# Altium schematic sheet CubSat2.SchDoc: CubSat
size A4; DrawnBy: Maymoun Jabnouni; SheetNumber: 2; SheetTotal: 3; SPICEModelCachePMNLYOBT: <root> / <DocumentId>PMNLYOBT</DocumentId> / <CacheFrame Number="0"> / <Model Name="cap" Kind="MDL"> / <Text>*Default semiconductor capacitor / .MODEL CAP C()</Text> / </Model> / </CacheFrame> / </root>
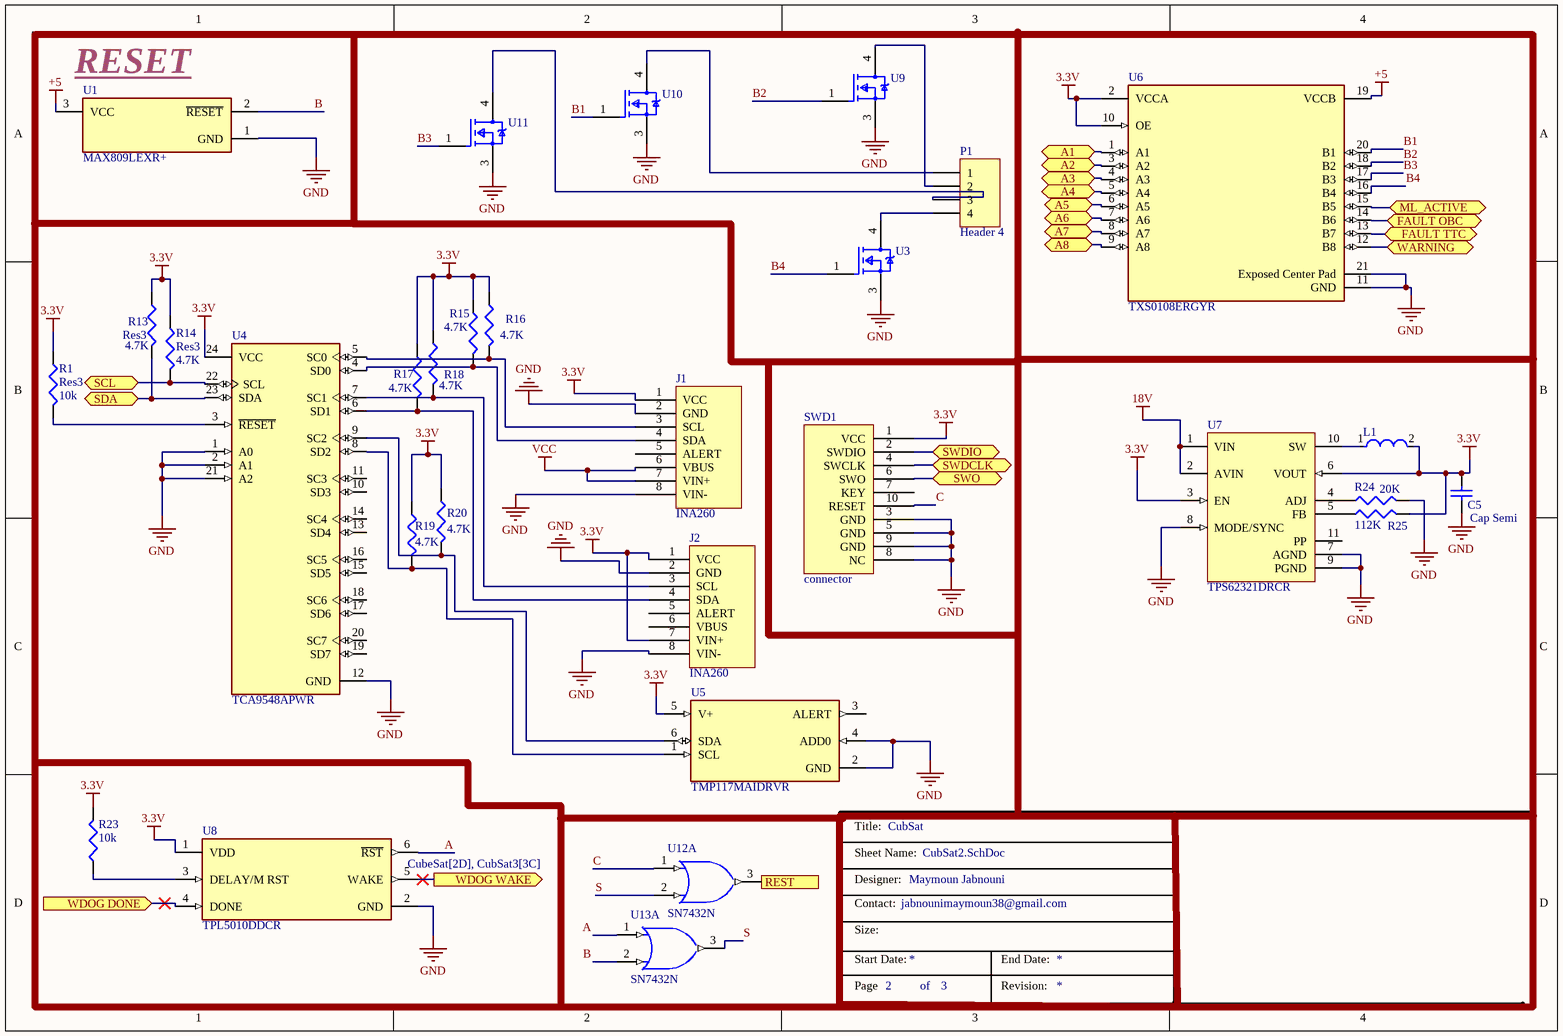
[diagram p0: CubSat2.SchDoc]

## Parts
C5  Cap Semi  [C1206]
J1  INA260  [INA260]
J2  INA260  [INA260]
L1  LQW31HN64NJ03L  [FP-LQW31HN_03-MFG]  (value not drawn)
P1  Header 4  [HDR1X4]
R1  Res3  value 10k  [J1-0603]
R13  Res3  value 4.7K  [J1-0603]
R14  Res3  value 4.7K  [J1-0603]
R15  value 4.7K  [J1-0603]  (hidden comment: Res3)
R16  value 4.7K  [J1-0603]  (hidden comment: Res3)
R17  value 4.7K  [J1-0603]  (hidden comment: Res3)
R18  value 4.7K  [J1-0603]  (hidden comment: Res3)
R19  value 4.7K  [J1-0603]  (hidden comment: Res3)
R20  value 4.7K  [J1-0603]  (hidden comment: Res3)
R23  value 10k  [J1-0603]  (hidden comment: Res3)
R24  value 20K  [J1-0603]  (hidden comment: Res3)
R25  value 112K  [J1-0603]  (hidden comment: Res3)
SWD1  connector  [SWD]
U1  MAX809LEXR+  [FP-X3-2-IPC_B]
U3  IRLR8743TRLPBF  [FP-PG-TO252-3-MFG]  (value not drawn)
U4  TCA9548APWR  [FP-PW0024A-MFG]
U5  TMP117MAIDRVR  [FP-DRV0006B-IPC_C]
U6  TXS0108ERGYR  [FP-RGY0020A-MFG]
U7  TPS62321DRCR  [DRC0010J_V]
U8  TPL5010DDCR  [FP-DDC0006A-MFG]
U9  IRLR8743TRLPBF  [FP-PG-TO252-3-MFG]  (value not drawn)
U10  IRLR8743TRLPBF  [FP-PG-TO252-3-MFG]  (value not drawn)
U11  IRLR8743TRLPBF  [FP-PG-TO252-3-MFG]  (value not drawn)
U12  SN7432N  [N0014A]  (part A of 5)
U13  SN7432N  [N0014A]  (part A of 5)

## Ports
A1 (bidir, see CubeSat[2D]), A2 (bidir, see CubeSat[2D]), A3 (bidir, see CubeSat[2D]), A4 (bidir, see CubeSat[2D]), A5 (bidir, see CubeSat[1C]), A6 (bidir, see CubeSat[1C]), A7 (bidir, see CubeSat[1C]), A8 (bidir, see CubeSat[1C]), FAULT OBC (bidir, see CubSat3[1C]), FAULT TTC (bidir, see CubSat3[1D]), ML_ACTIVE (bidir, see CubSat3[2A]), REST (out, see CubeSat[1C]), SCL (bidir, see CubeSat[2A]), SDA (bidir, see CubeSat[2A]), SWDCLK (bidir, see CubeSat[3A], CubSat3[3C]), SWDIO (bidir, see CubeSat[3B], CubSat3[3C]), SWO (bidir, see CubeSat[2A]), WARNING (bidir, see CubSat3[3A]), WDOG DONE (in, see CubeSat[2D], CubSat3[3C]), WDOG WAKE (out, see CubeSat[2D], CubSat3[3C])

## Nets
3.3V: C5.2 J1.1(VCC) J2.1(VCC) J2.7(VIN+) L1.2 R1.1 R13.1 R14.1 R15.1 R16.1 R17.1 R18.1 R19.1 R20.1 R23.2 R25.2 SWD1.1(VCC) U4.24(VCC) U5.5(V+) U6.2(VCCA) U6.10(OE) U7.3(EN) U7.6(VOUT) U8.1(VDD)
18V: U7.1(VIN) U7.2(AVIN)
+5: U1.3(VCC) U6.19(VCCB)
GND: C5.1 J1.2(GND) J1.8(VIN-) J2.2(GND) J2.8(VIN-) R24.2 SWD1.3(GND) SWD1.5(GND) SWD1.8(NC) SWD1.9(GND) U1.1(GND) U3.3(S) U4.1(A0) U4.2(A1) U4.12(GND) U4.21(A2) U5.2(GND) U5.4(ADD0) U6.11(GND) U6.21(Exposed_Center_Pad) U7.7(AGND) U7.8(MODE/SYNC) U7.9(PGND) U8.2(GND) U9.3(S) U10.3(S) U11.3(S)
VCC: J1.6(VBUS) J1.7(VIN+)
A: U8.6(~{RST}) U13.1(1A)
A1: U6.1(A1) ; port A1
A2: U6.3(A2) ; port A2
A3: U6.4(A3) ; port A3
A4: U6.5(A4) ; port A4
A5: U6.6(A5) ; port A5
A6: U6.7(A6) ; port A6
A7: U6.8(A7) ; port A7
A8: U6.9(A8) ; port A8
B: U1.2(~{RESET}) U13.2(1B)
B1: U6.20(B1) U10.1(G)
B2: U6.18(B2) U9.1(G)
B3: U6.17(B3) U11.1(G)
B4: U3.1(G) U6.16(B4)
C: SWD1.10(RESET) U12.1(1A)
FAULT OBC: U6.14(B6) ; port FAULT OBC
FAULT TTC: U6.13(B7) ; port FAULT TTC
ML_ACTIVE: U6.15(B5) ; port ML_ACTIVE
REST: U12.3(1Y) ; port REST
S: U12.2(1B) U13.3(1Y)
SCL: R14.2 U4.22(SCL) ; port SCL
SDA: R13.2 U4.23(SDA) ; port SDA
SWDCLK: SWD1.4(SWCLK) ; port SWDCLK
SWDIO: SWD1.2(SWDIO) ; port SWDIO
SWO: SWD1.6(SWO) ; port SWO
WARNING: U6.12(B8) ; port WARNING
WDOG DONE: U8.4(DONE) ; port WDOG DONE
WDOG WAKE: U8.5(WAKE) ; port WDOG WAKE
NetJ1_3: J1.3(SCL) R16.2 U4.5(SC0)
NetJ1_4: J1.4(SDA) R15.2 U4.4(SD0)
NetJ2_3: J2.3(SCL) R18.2 U4.7(SC1)
NetJ2_4: J2.4(SDA) R17.2 U4.6(SD1)
NetL1_1: L1.1 U7.10(SW)
NetP1_1: P1.1 U10.4(D)
NetP1_2: P1.2 U9.4(D)
NetP1_3: P1.3 U11.4(D)
NetP1_4: P1.4 U3.4(D)
NetR1_2: R1.2 U4.3(~{RESET})
NetR19_2: R19.2 U4.8(SD2) U5.1(SCL)
NetR20_2: R20.2 U4.9(SC2) U5.6(SDA)
NetR23_1: R23.1 U8.3(DELAY/M_RST)
NetR24_1: R24.1 U7.4(ADJ)
NetR25_1: R25.1 U7.5(FB)

Not connected (* = marked no-connect by the designer): J1 5(ALERT); J2 5(ALERT) 6(VBUS); SWD1 7(KEY); U4 10(SD3) 11(SC3) 13(SD4) 14(SC4) 15(SD5) 16(SC5) 17(SD6) 18(SC6) 19(SD7) 20(SC7); U5 3(ALERT); U7 11(PP)

## Notes on the sheet
- (near U1) RESET
- Title:
- Sheet Name:
- Designer:
- Contact:
- jabnounimaymoun38@gmail.com
- Size:
- Start Date:
- Page
- of
- End Date:
- Revision:

## Library data of the parts
C5 = Cap Semi: Capacitor (Semiconductor SIM Model); Value: 100pF; Published: 8-Jun-2000; LatestRevisionDate: 29-May-2009; LatestRevisionNote: IPC-7351 Footprint Added.; PackageReference: C1206; Publisher: Altium Limited; PackageDescription: Chip Capacitor
L1 = CMP-06042-010302-1: Wire Wound RF Inductor 64nH ±5% 0.252Ω 290mA 1206; Shielding: Unshielded; Core Material: Ferrite; Self Resonant Frequency: 1GHz; DC Resistance (DCR): 180mR; Q Factor: 60; Test Frequency: 100MHz; Height - Seated (Max): 0.079inch; Max DC Current: 290mA; Radiation Hardening: No; Height: 1.8mm; Tolerance: 5%; Case Code (Metric): 3216; Min Operating Temperature: -55°C; Inductance: 64nH; Weight: 0.000705oz; Length: 3.2mm; Termination: SMD/SMT; Package Quantity: 2000; Packaging: Tape and Reel; Case/Package: 1206; DC Current: 290mA; Military Standard: Not; Max Operating Temperature: 85°C; Depth: 1.8mm; Resistor Type: Wirewound; Case Code (Imperial): 1206; Mount: Surface Mount; Current Rating: 290mA; Width: 1.6mm
P1 = Header 4: Header, 4-Pin; LatestRevisionDate: 17-Jul-2002; LatestRevisionNote: Re-released for DXP Platform.; Publisher: Altium Limited
R1 R13-R20 R23-R25 = Res3: Resistor; Published: 8-Jun-2000; LatestRevisionDate: 29-May-2009; LatestRevisionNote: IPC-7351 Footprint Added.; PackageReference: J1-0603; Publisher: Altium Limited; PackageDescription: Chip Resistor
SWD1 = SWD
U1 = CMP-05723-000292-1: Supervisory Circuits 3-Pin Microprocessor Reset Circuits; Max Supply Voltage: 5.5V; Min Reset Threshold Voltage: 4.56V; Max Power Dissipation: 174mW; Min Supply Voltage: 1.2V; Watchdog Timer: No; Max Reset Threshold Voltage: 4.7V; Radiation Hardening: No; Min Operating Temperature: -40°C; Max Operating Temperature: 125°C; Packaging: Rail/Tube; Mount: Surface Mount; RoHS Compliant: No
U3 U9-U11 = CMP-32901-000199-1: MOSFET N-CH 30V 160A DPAK; Input Capacitance: 4.88nF; Rds On Max: 3.1mR; Max Power Dissipation: 135W; Number of Pins: 3; Min Operating Temperature: -55°C; Case/Package: TO-252-3; Mount: Surface Mount; Halogen Free: Halogen Free; Max Dual Supply Voltage: 30V; RoHS Compliant: Yes; Continuous Drain Current (ID): 160A; Drain to Source Voltage (Vdss): 30V; Packaging: Tape and Reel; Max Operating Temperature: 175°C; Lead Free: Contains Lead
U4 = CMP-04892-000002-1: IC I2C SW 8CH W/RESET 24TSSOP; Manufacturer: Texas Instruments; Number Of Circuits: 1; Mux Demux Ratio: 1:8; Nominal Supply Current: 2-50uA; Interface: I2C,SMBus; Min Supply Voltage: 1.65V; Standoff Height: 0.05mm; Max Supply Voltage: 5.5V; Device Class L2: Interface ICs; ComponentLink2Description: Datasheet; Ipc Land Pattern Name: SOP65P640X120-24; Category: IC; Device Class L1: Integrated Circuits (ICs); Manufacturer Part Number: TCA9548APWR; RoHS: TRUE; Temperature Range High: +85°C; Digikey Description: IC I2C SW 8CH W/RESET 24TSSOP; Temperature Range Low: -40°C; Lead Free: Yes; Package: PW0024A; ComponentLink2URL: http://www.ti.com/lit/ds/symlink/tca9548a.pdf; Device Class L3: Multiplexers; Ambient Temperature Range Low: -40°C; Mouser Description: Low-Voltage 8-Channel I2C Switch With Reset 24-TSSOP -40 to 85; Temperature: -40°C to +85°C; Octopart: https://octopart.com/tca9548apwr-texas+instruments-22266789; Ambient Temperature Range High: +85°C; Automotive: No; Height: 1.2mm
U5 = CMP-04948-000036-1: TEMPERATURE SENSOR; Resolution: 16b; Output Type: I2C; Packaging: Cut Tape; Mount: Surface Mount; Min Operating Temperature: -55°C; Max Operating Temperature: 150°C; RoHS Compliant: Yes
U6 = CMP-04899-000066-1: IC TRNSLTR BIDIRECTIONAL 20VQFN; Propagation Delay: 4.8ns; Number of Channels: 8; High Level Output Current: -50mA; Min Supply Voltage: 1.2V; Data Rate: 60Mbps; Quiescent Current: 3uA; Logic Function: Translator; Low Level Output Current: 50mA; Max Supply Voltage: 5.5V; Output Type: Voltage; Turn-On Delay Time: 312ns; Packaging: Tape and Reel; Min Operating Temperature: -40°C; Package Quantity: 1; Case/Package: VQFN; Mount: Surface Mount; Number of Pins: 20; Radiation Hardening: No; Series: -; RoHS Compliant: Yes; REACH SVHC: No SVHC; Max Operating Temperature: 85°C; Number of Bits: 8; Lead Free: Lead Free; Weight: 0.001517oz; Number of Inputs: 8
U7 = CMP-0323-00234-3: Buck Step Down Regulator with 2.7 to 6 V Input and 1.5 V Output, -40 to 85 degC, 10-Pin SON (DRC), Green (RoHS & no Sb/Br); Manufacturer: Texas Instruments; Vin(Max)(V): 6; Vin(Min)(V): 2.7; Vout(Min)(V): 1.5; Switch Current Limit(Typ)(A): 0.74; SubFamily: Step-Down Regulator; Duty Cycle(Max)(%): 100; Iq(Typ)(mA): 0.086; Synchronous Rectification: TRUE; Regulated Outputs(#): 1; Rating: Catalog; Iout(Max)(A): 0.5; DatasheetVersion: SLVS528E; Mounting Technology: Surface Mount; PartNumber: TPS62321DRCR; PackageVersion: revL, Sep-2011; ComponentLink3Description: URL Link1; ComponentLink2URL: http://www.ti.com/litv/pdf/mpds117k; PackageReference: DRC0010J; ComponentLink1Description: Datasheet; Preset Vout(V): 1.5; PackageDescription: 10-Pin Plastic Small Outline No-Lead, 3 x 3 x 1 mm Body, 0.5 mm Pitch, Exposed Pad; ComponentLink1URL: http://www.ti.com/general/docs/lit/getliterature.tsp?genericPartNumber=TPS62321&fileType=pdf; Topology: Buck; ComponentLink2Description: Package Specification; Eco-Plan: Green (RoHS & no Sb/Br); Vout(Max)(V): 1.5; ComponentLink3URL: Samples URL:http://www.ti.com/product/tps62321#samples
U8 = CMP-04858-000006-1: IC OSC PROG TIMER TSOT23-6; Manufacturer: Texas Instruments; Number Of Timers/Counters: 1; Nominal Supply Current: 0.035uA; Min Supply Voltage: 1.8V; Standoff Height: 0mm; Max Junction Temp: +150°C; Max Supply Voltage: 5.5V; Temperature Range Low: -40°C; Device Class L2: Clock and Timing; Category: IC; Device Class L3: Timers and Oscillators; Mouser Description: Timers & Support Products UltraLowPowrTimWatch dogfunctnManualReset; Temperature: -40°C to +105°C; Package: DDC0006A; Manufacturer Part Number: TPL5010DDCR; Temperature Range High: +105°C; ComponentLink2Description: Datasheet; Lead Free: Yes; Device Class L1: Integrated Circuits (ICs); Height: 1.1mm; Digikey Description: IC OSC PROG TIMER TSOT23-6; Ipc Land Pattern Name: SOT95P280X110-6; ComponentLink2URL: http://www.ti.com/lit/ds/symlink/tpl5010.pdf; RoHS: TRUE; Octopart: https://octopart.com/tpl5010ddcr-texas+instruments-52670268; Automotive: No
U12 U13 = CMP-1573-00140-3: Quad 2-input positive-OR gates, N0014A, TUBE; Manufacturer: Texas Instruments; Generic Part Number: SN7432; VCC(Max)(V): 5.25; Voltage(Nom)(V): 5; VCC(Min)(V): 4.75; F @ Nom Voltage(Max)(Mhz): 100; Output Type: TTL; Output Drive (IOL/IOH)(Max)(mA): 0.8/-16; ICC @ Nom Voltage(Max)(mA): 0.038; Bits(#): 4; tpd @ Nom Voltage(Max)(ns): 22; Rating: Catalog; PackageVersion: http://www.ti.com/lit/ml/mpdi002c/mpdi002c.pdf; Operating Temperature Range(C): 0 to 70; DatasheetVersion: SDLS100; Code_JEDEC: MS-001; Input Type: TTL; PackageReference: N0014A